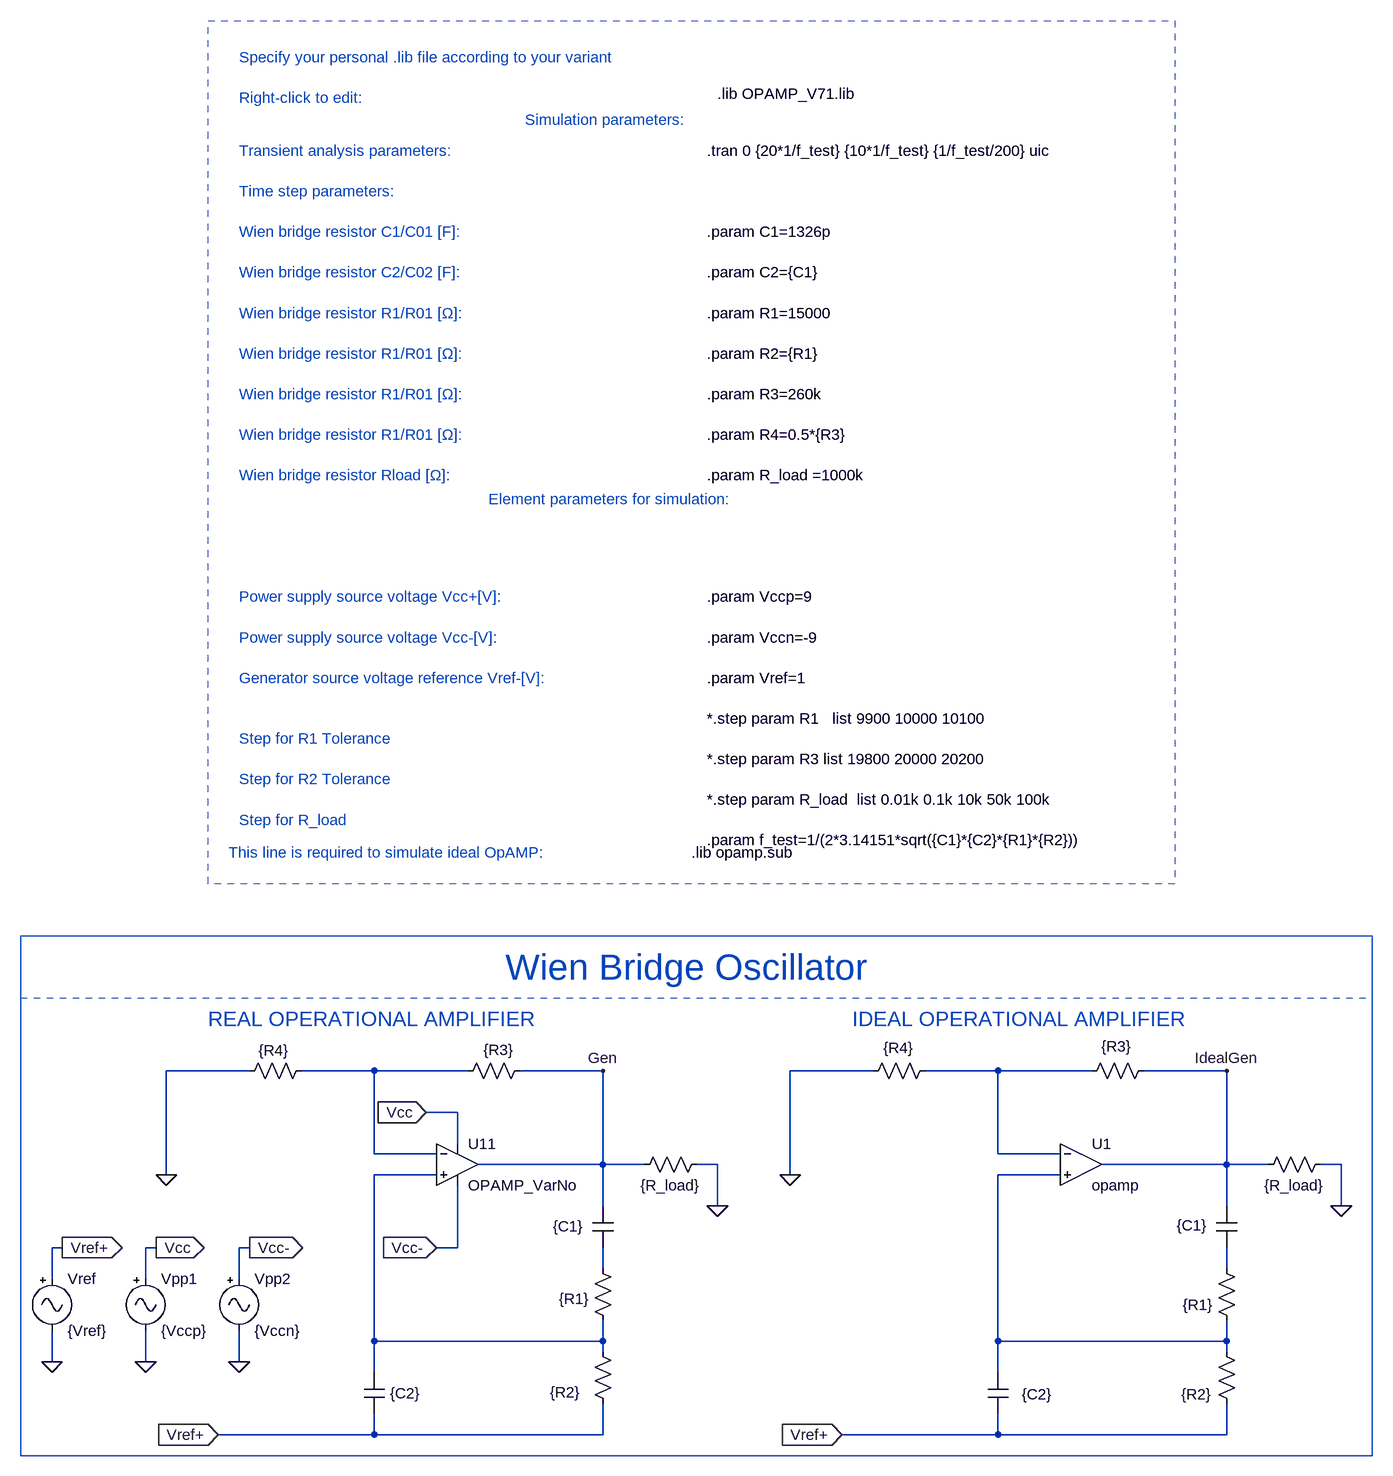
[diagram p0: schematic Pract3. Wien.asc]
Pract3. Wien.asc, the LTspice schematic file:
Version 4
SHEET 1 3472 2868
WIRE 16 1872 -112 1872
WIRE 208 1872 96 1872
WIRE 352 1872 208 1872
WIRE 560 1872 432 1872
WIRE 976 1872 848 1872
WIRE 1168 1872 1056 1872
WIRE 1312 1872 1168 1872
WIRE 1520 1872 1392 1872
WIRE 336 1936 288 1936
WIRE 336 1984 336 1936
WIRE 208 2000 208 1872
WIRE 304 2000 208 2000
WIRE 1168 2000 1168 1872
WIRE 1264 2000 1168 2000
WIRE 560 2016 560 1872
WIRE 560 2016 368 2016
WIRE 624 2016 560 2016
WIRE 736 2016 704 2016
WIRE 1520 2016 1520 1872
WIRE 1520 2016 1328 2016
WIRE 1584 2016 1520 2016
WIRE 1696 2016 1664 2016
WIRE -112 2032 -112 1872
WIRE 304 2032 208 2032
WIRE 848 2032 848 1872
WIRE 1264 2032 1168 2032
WIRE 560 2080 560 2016
WIRE 736 2080 736 2016
WIRE 1520 2080 1520 2016
WIRE 1696 2080 1696 2016
WIRE -272 2144 -288 2144
WIRE -128 2144 -144 2144
WIRE 16 2144 0 2144
WIRE 336 2144 336 2048
WIRE 336 2144 304 2144
WIRE 560 2176 560 2144
WIRE 1520 2176 1520 2144
WIRE -288 2192 -288 2144
WIRE -144 2192 -144 2144
WIRE 0 2192 0 2144
WIRE 208 2288 208 2032
WIRE 560 2288 560 2256
WIRE 560 2288 208 2288
WIRE 1168 2288 1168 2032
WIRE 1520 2288 1520 2256
WIRE 1520 2288 1168 2288
WIRE 560 2304 560 2288
WIRE 1520 2304 1520 2288
WIRE -288 2320 -288 2272
WIRE -144 2320 -144 2272
WIRE 0 2320 0 2272
WIRE 208 2336 208 2288
WIRE 1168 2336 1168 2288
WIRE 208 2432 208 2400
WIRE 208 2432 -32 2432
WIRE 560 2432 560 2384
WIRE 560 2432 208 2432
WIRE 1168 2432 1168 2400
WIRE 1168 2432 928 2432
WIRE 1520 2432 1520 2384
WIRE 1520 2432 1168 2432
FLAG 304 2144 Vcc-
IOPIN 304 2144 In
FLAG 288 1936 Vcc
IOPIN 288 1936 In
FLAG 560 1872 Gen
FLAG -32 2432 Vref+
IOPIN -32 2432 In
FLAG 736 2080 0
FLAG -112 2032 0
FLAG -288 2320 0
FLAG -144 2320 0
FLAG -272 2144 Vref+
IOPIN -272 2144 Out
FLAG -128 2144 Vcc
IOPIN -128 2144 Out
FLAG 0 2320 0
FLAG 16 2144 Vcc-
IOPIN 16 2144 Out
FLAG 1520 1872 IdealGen
FLAG 928 2432 Vref+
IOPIN 928 2432 In
FLAG 1696 2080 0
FLAG 848 2032 0
SYMBOL OpAmps\\opamp2 336 1952 R0
SYMATTR InstName U11
SYMATTR Value OPAMP_VarNo
SYMBOL res 112 1856 R90
WINDOW 0 0 56 Invisible 2
WINDOW 3 -31 58 VTop 2
SYMATTR InstName R4
SYMATTR Value {R4}
SYMBOL res 448 1856 R90
WINDOW 0 0 56 Invisible 2
WINDOW 3 -32 48 VTop 2
SYMATTR InstName R3
SYMATTR Value {R3}
SYMBOL res 576 2400 R180
WINDOW 0 36 76 Invisible 2
WINDOW 3 50 33 Left 2
SYMATTR InstName R2
SYMATTR Value {R2}
SYMBOL res 720 2000 R90
WINDOW 0 0 56 Invisible 2
WINDOW 3 33 56 VTop 2
SYMATTR InstName R23
SYMATTR Value {R_load}
SYMBOL cap 192 2336 R0
WINDOW 0 24 8 Invisible 2
WINDOW 3 40 32 Left 2
SYMATTR InstName C2
SYMATTR Value {C2}
SYMBOL cap 544 2080 R0
WINDOW 0 24 8 Invisible 2
WINDOW 3 -61 31 Left 2
SYMATTR InstName C1
SYMATTR Value {C1}
SYMBOL res 576 2272 R180
WINDOW 0 36 76 Invisible 2
WINDOW 3 36 49 Left 2
SYMATTR InstName R1
SYMATTR Value {R1}
SYMBOL Misc\\signal -144 2176 R0
WINDOW 123 0 0 Left 0
WINDOW 39 0 0 Left 0
SYMATTR InstName Vpp1
SYMATTR Value {Vccp}
SYMBOL Misc\\signal -288 2176 R0
WINDOW 123 0 0 Left 0
WINDOW 39 0 0 Left 0
SYMATTR InstName Vref
SYMATTR Value {Vref}
SYMBOL Misc\\signal 0 2176 R0
WINDOW 123 0 0 Left 0
WINDOW 39 0 0 Left 0
SYMATTR InstName Vpp2
SYMATTR Value {Vccn}
SYMBOL OpAmps\\opamp 1296 1952 R0
SYMATTR InstName U1
SYMBOL res 1072 1856 R90
WINDOW 0 0 56 Invisible 2
WINDOW 3 -35 57 VTop 2
SYMATTR InstName R5
SYMATTR Value {R4}
SYMBOL res 1408 1856 R90
WINDOW 0 0 56 Invisible 2
WINDOW 3 -37 57 VTop 2
SYMATTR InstName R6
SYMATTR Value {R3}
SYMBOL res 1536 2400 R180
WINDOW 0 36 76 Invisible 2
WINDOW 3 39 30 Left 2
SYMATTR InstName R7
SYMATTR Value {R2}
SYMBOL res 1680 2000 R90
WINDOW 0 0 56 Invisible 2
WINDOW 3 33 56 VTop 2
SYMATTR InstName R8
SYMATTR Value {R_load}
SYMBOL cap 1152 2336 R0
WINDOW 0 24 8 Invisible 2
WINDOW 3 53 34 Left 2
SYMATTR InstName C3
SYMATTR Value {C2}
SYMBOL cap 1504 2080 R0
WINDOW 0 24 8 Invisible 2
WINDOW 3 -61 30 Left 2
SYMATTR InstName C4
SYMATTR Value {C1}
SYMBOL res 1536 2272 R180
WINDOW 0 36 76 Invisible 2
WINDOW 3 36 40 Left 2
SYMATTR InstName R9
SYMATTR Value {R1}
TEXT 720 456 Left 2 !.tran 0 {20*1/f_test} {10*1/f_test} {1/f_test/200} uic\n \n \n  \n.param C1=1326p\n \n.param C2={C1} \n  \n.param R1=15000\n \n.param R2={R1}\n   \n.param R3=260k\n \n.param R4=0.5*{R3}\n \n.param R_load =1000k\n \n \n \n \n \n.param Vccp=9\n \n.param Vccn=-9\n \n.param Vref=1\n \n*.step param R1   list 9900 10000 10100 \n \n*.step param R3 list 19800 20000 20200\n \n*.step param R_load  list 0.01k 0.1k 10k 50k 100k\n \n.param f_test=1/(2*3.14151*sqrt({C1}*{C2}*{R1}*{R2}))
TEXT 736 368 Left 2 !.lib OPAMP_V71.lib
TEXT 0 312 Left 2 ;Specify your personal .lib file according to your variant\n \nRight-click to edit:
TEXT 440 408 Left 2 ;Simulation parameters:
TEXT 384 992 Left 2 ;Element parameters for simulation:
TEXT 0 456 Left 2 ;Transient analysis parameters:\n \nTime step parameters:\n \nWien bridge resistor C1/C01 [F]:\n \nWien bridge resistor C2/C02 [F]: \n \nWien bridge resistor R1/R01 [Ω]:\n \nWien bridge resistor R1/R01 [Ω]:\n \nWien bridge resistor R1/R01 [Ω]:\n \nWien bridge resistor R1/R01 [Ω]:\n \nWien bridge resistor Rload [Ω]:\n \n  \n  \n \n \nPower supply source voltage Vcc+[V]:\n \nPower supply source voltage Vcc-[V]: \n \nGenerator source voltage reference Vref-[V]: \n \n \nStep for R1 Tolerance\n \nStep for R2 Tolerance\n \nStep for R_load
TEXT 696 1536 Left 2 !.lib opamp.sub
TEXT -16 1536 Left 2 ;This line is required to simulate ideal OpAMP:
TEXT 944 1792 Left 3 ;IDEAL OPERATIONAL AMPLIFIER
TEXT -48 1792 Left 3 ;REAL OPERATIONAL AMPLIFIER
TEXT 688 1712 Center 5 ;Wien Bridge Oscillator
RECTANGLE Normal 1440 1584 -48 256 2
RECTANGLE Normal 1744 2464 -336 1760 2
RECTANGLE Normal 1744 2464 -336 1664

The netlist it stands for:
* Pract3. Wien.asc
XU11 N003 N001 Vcc Vcc- Gen OPAMP_VarNo  ; pins In+ In- V+ V- OUT
R4 N001 0 {R4}
R3 Gen N001 {R3}
R2 Vref+ N003 {R2}
R23 0 Gen {R_load}
C2 N003 Vref+ {C2}
C1 Gen N005 {C1}
R1 N003 N005 {R1}
Vpp1 Vcc 0 {Vccp}
Vref Vref+ 0 {Vref}
Vpp2 Vcc- 0 {Vccn}
XU1 N002 N004 IdealGen opamp Aol=100K GBW=10Meg  ; pins invin noninvin out
R5 N002 0 {R4}
R6 IdealGen N002 {R3}
R7 Vref+ N004 {R2}
R8 0 IdealGen {R_load}
C3 N004 Vref+ {C2}
C4 IdealGen N006 {C1}
R9 N004 N006 {R1}
.tran 0 {20*1/f_test} {10*1/f_test} {1/f_test/200} uic
.param C1=1326p
.param C2={C1}
.param R1=15000
.param R2={R1}
.param R3=260k
.param R4=0.5*{R3}
.param R_load =1000k
.param Vccp=9
.param Vccn=-9
.param Vref=1
*.step param R1   list 9900 10000 10100
*.step param R3 list 19800 20000 20200
*.step param R_load  list 0.01k 0.1k 10k 50k 100k
.param f_test=1/(2*3.14151*sqrt({C1}*{C2}*{R1}*{R2}))
.lib OPAMP_V71.lib
* Specify your personal .lib file according to your variant
* Right-click to edit:
* Simulation parameters:
* Element parameters for simulation:
* Transient analysis parameters:
* Time step parameters:
* Wien bridge resistor C1/C01 [F]:
* Wien bridge resistor C2/C02 [F]:
* Wien bridge resistor R1/R01 [Ω]:
* Wien bridge resistor R1/R01 [Ω]:
* Wien bridge resistor R1/R01 [Ω]:
* Wien bridge resistor R1/R01 [Ω]:
* Wien bridge resistor Rload [Ω]:
* Power supply source voltage Vcc+[V]:
* Power supply source voltage Vcc-[V]:
* Generator source voltage reference Vref-[V]:
* Step for R1 Tolerance
* Step for R2 Tolerance
* Step for R_load
.lib opamp.sub
* This line is required to simulate ideal OpAMP:
* IDEAL OPERATIONAL AMPLIFIER
* REAL OPERATIONAL AMPLIFIER
* Wien Bridge Oscillator
.backanno
.end

* Results of the author's LTspice run, read from the files saved beside the schematic
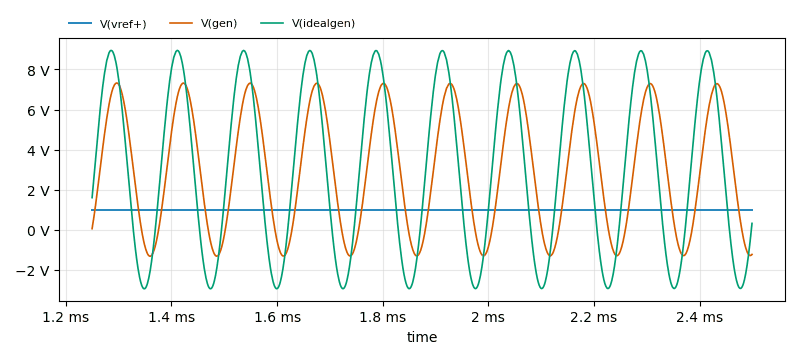
[diagram p1: Transient Analysis of Pract3. Wien.asc, plotted from the saved traces]
* Transient Analysis, 1 run:
*   V(vref+): min 1 V, max 1 V, average 1 V, rms 1 V, last 1 V
*   V(gen): min -1.329 V, max 7.325 V, average 3.038 V, rms 4.299 V, last -1.237 V
*   V(idealgen): min -2.955 V, max 8.956 V, average 3.005 V, rms 5.172 V, last 313.7 mV